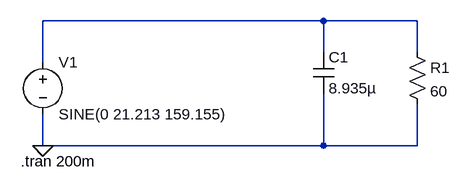
[diagram p0: schematic Draft2.asc]
Draft2.asc, the LTspice schematic file:
Version 4
SHEET 1 880 680
WIRE 512 -64 80 -64
WIRE 656 -64 512 -64
WIRE 512 -16 512 -64
WIRE 656 -16 656 -64
WIRE 80 0 80 -64
WIRE 80 128 80 80
WIRE 512 128 512 48
WIRE 512 128 80 128
WIRE 656 128 656 64
WIRE 656 128 512 128
FLAG 80 128 0
SYMBOL voltage 80 -16 R0
WINDOW 123 0 0 Left 0
WINDOW 39 0 0 Left 0
SYMATTR InstName V1
SYMATTR Value SINE(0 21.213 159.155)
SYMBOL res 640 -32 R0
SYMATTR InstName R1
SYMATTR Value 60
SYMBOL cap 496 -16 R0
SYMATTR InstName C1
SYMATTR Value 8.935µ
TEXT 46 152 Left 2 !.tran 200m

The netlist it stands for:
* Draft2.asc
V1 N001 0 SINE(0 21.213 159.155)
R1 N001 0 60
C1 N001 0 8.935µ
.tran 200m
.backanno
.end